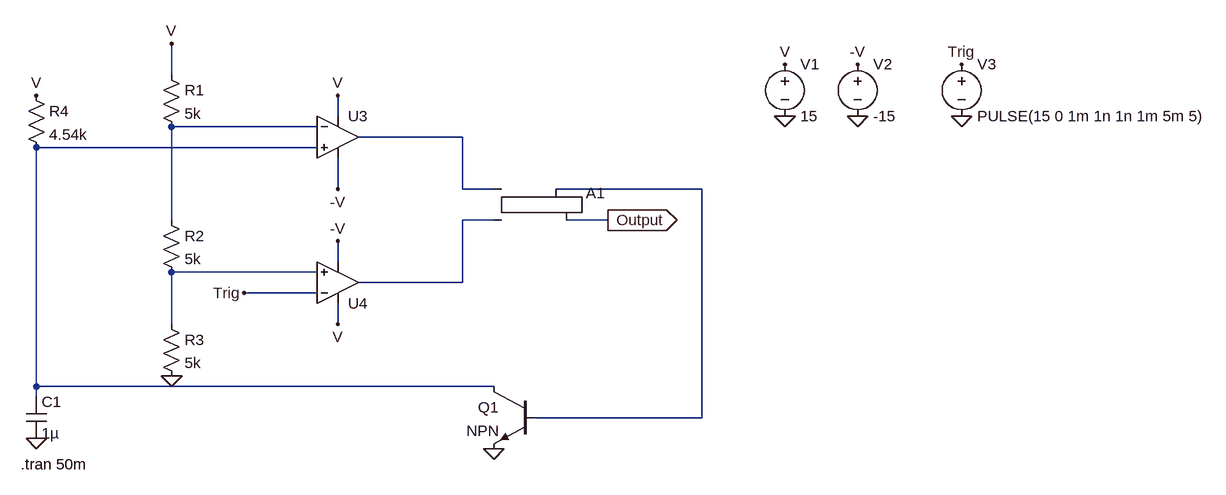
[diagram p0: schematic 1a.asc]
1a.asc, the LTspice schematic file:
Version 4.1
SHEET 1 2088 680
WIRE 48 0 48 -48
WIRE 304 64 304 32
WIRE 272 80 48 80
WIRE 496 96 336 96
WIRE 272 112 -160 112
WIRE 304 176 304 128
WIRE 496 176 496 96
WIRE 544 176 496 176
WIRE 864 176 640 176
WIRE 48 224 48 80
WIRE 544 224 496 224
WIRE 720 224 656 224
WIRE 304 288 304 256
WIRE 272 304 48 304
WIRE 496 320 496 224
WIRE 496 320 336 320
WIRE 272 336 160 336
WIRE 48 384 48 304
WIRE 304 384 304 352
WIRE -160 480 -160 112
WIRE 544 480 -160 480
WIRE -160 496 -160 480
WIRE 864 528 864 176
WIRE 864 528 608 528
FLAG 48 464 0
FLAG 48 -48 V
FLAG 304 32 V
FLAG 304 256 -V
FLAG -160 32 V
FLAG -160 560 0
FLAG 544 576 0
FLAG 720 224 Output
IOPIN 720 224 Out
FLAG 304 384 V
FLAG 304 176 -V
FLAG 160 336 Trig
FLAG 992 64 0
FLAG 1104 64 0
FLAG 992 -16 V
FLAG 1104 -16 -V
FLAG 1264 64 0
FLAG 1264 -16 Trig
SYMBOL res 32 -16 R0
SYMATTR InstName R1
SYMATTR Value 5k
SYMBOL res 32 208 R0
SYMATTR InstName R2
SYMATTR Value 5k
SYMBOL res 32 368 R0
SYMATTR InstName R3
SYMATTR Value 5k
SYMBOL res -176 16 R0
SYMATTR InstName R4
SYMATTR Value 4.54k
SYMBOL cap -176 496 R0
SYMATTR InstName C1
SYMATTR Value 1µ
SYMBOL Digital\\srflop 592 128 R0
SYMATTR InstName A1
SYMBOL npn 608 480 M0
SYMATTR InstName Q1
SYMBOL voltage 992 -32 R0
SYMATTR InstName V1
SYMATTR Value 15
SYMBOL voltage 1104 -32 R0
SYMATTR InstName V2
SYMATTR Value -15
SYMBOL voltage 1264 -32 R0
WINDOW 123 0 0 Left 0
WINDOW 39 0 0 Left 0
SYMATTR InstName V3
SYMATTR Value PULSE(15 0 1m 1n 1n 1m 5m 5)
SYMBOL OpAmps\\UniversalOpAmp2 304 96 R0
SYMATTR InstName U3
SYMBOL OpAmps\\UniversalOpAmp2 304 320 M180
SYMATTR InstName U4
TEXT -184 600 Left 2 !.tran 50m

The netlist it stands for:
* 1a.asc
R1 V N001 5k
R2 N001 N006 5k
R3 N006 0 5k
R4 V N003 4.54k
C1 N003 0 1µ
A1 N002 N005 0 0 0 Output N004 0 SRFLOP
Q1 N003 N004 0 0 NPN
V1 V 0 15
V2 -V 0 -15
V3 Trig 0 PULSE(15 0 1m 1n 1n 1m 5m 5)
X§U3 N003 N001 V -V N002 level2 Avol=1Meg GBW=10Meg Slew=10Meg Ilimit=25m Rail=0 Vos=0 En=0 Enk=0 In=0 Ink=0 Rin=500Meg  ; pins In+ In- V+ V- OUT
X§U4 N006 Trig V -V N005 level2 Avol=1Meg GBW=10Meg Slew=10Meg Ilimit=25m Rail=0 Vos=0 En=0 Enk=0 In=0 Ink=0 Rin=500Meg  ; pins In+ In- V+ V- OUT
.model NPN NPN
.model PNP PNP
.lib standard.bjt
.tran 50m
.lib UniversalOpAmp2.lib
.backanno
.end